# EAGLE schematic EMG3 (EAGLE 9.3.1)
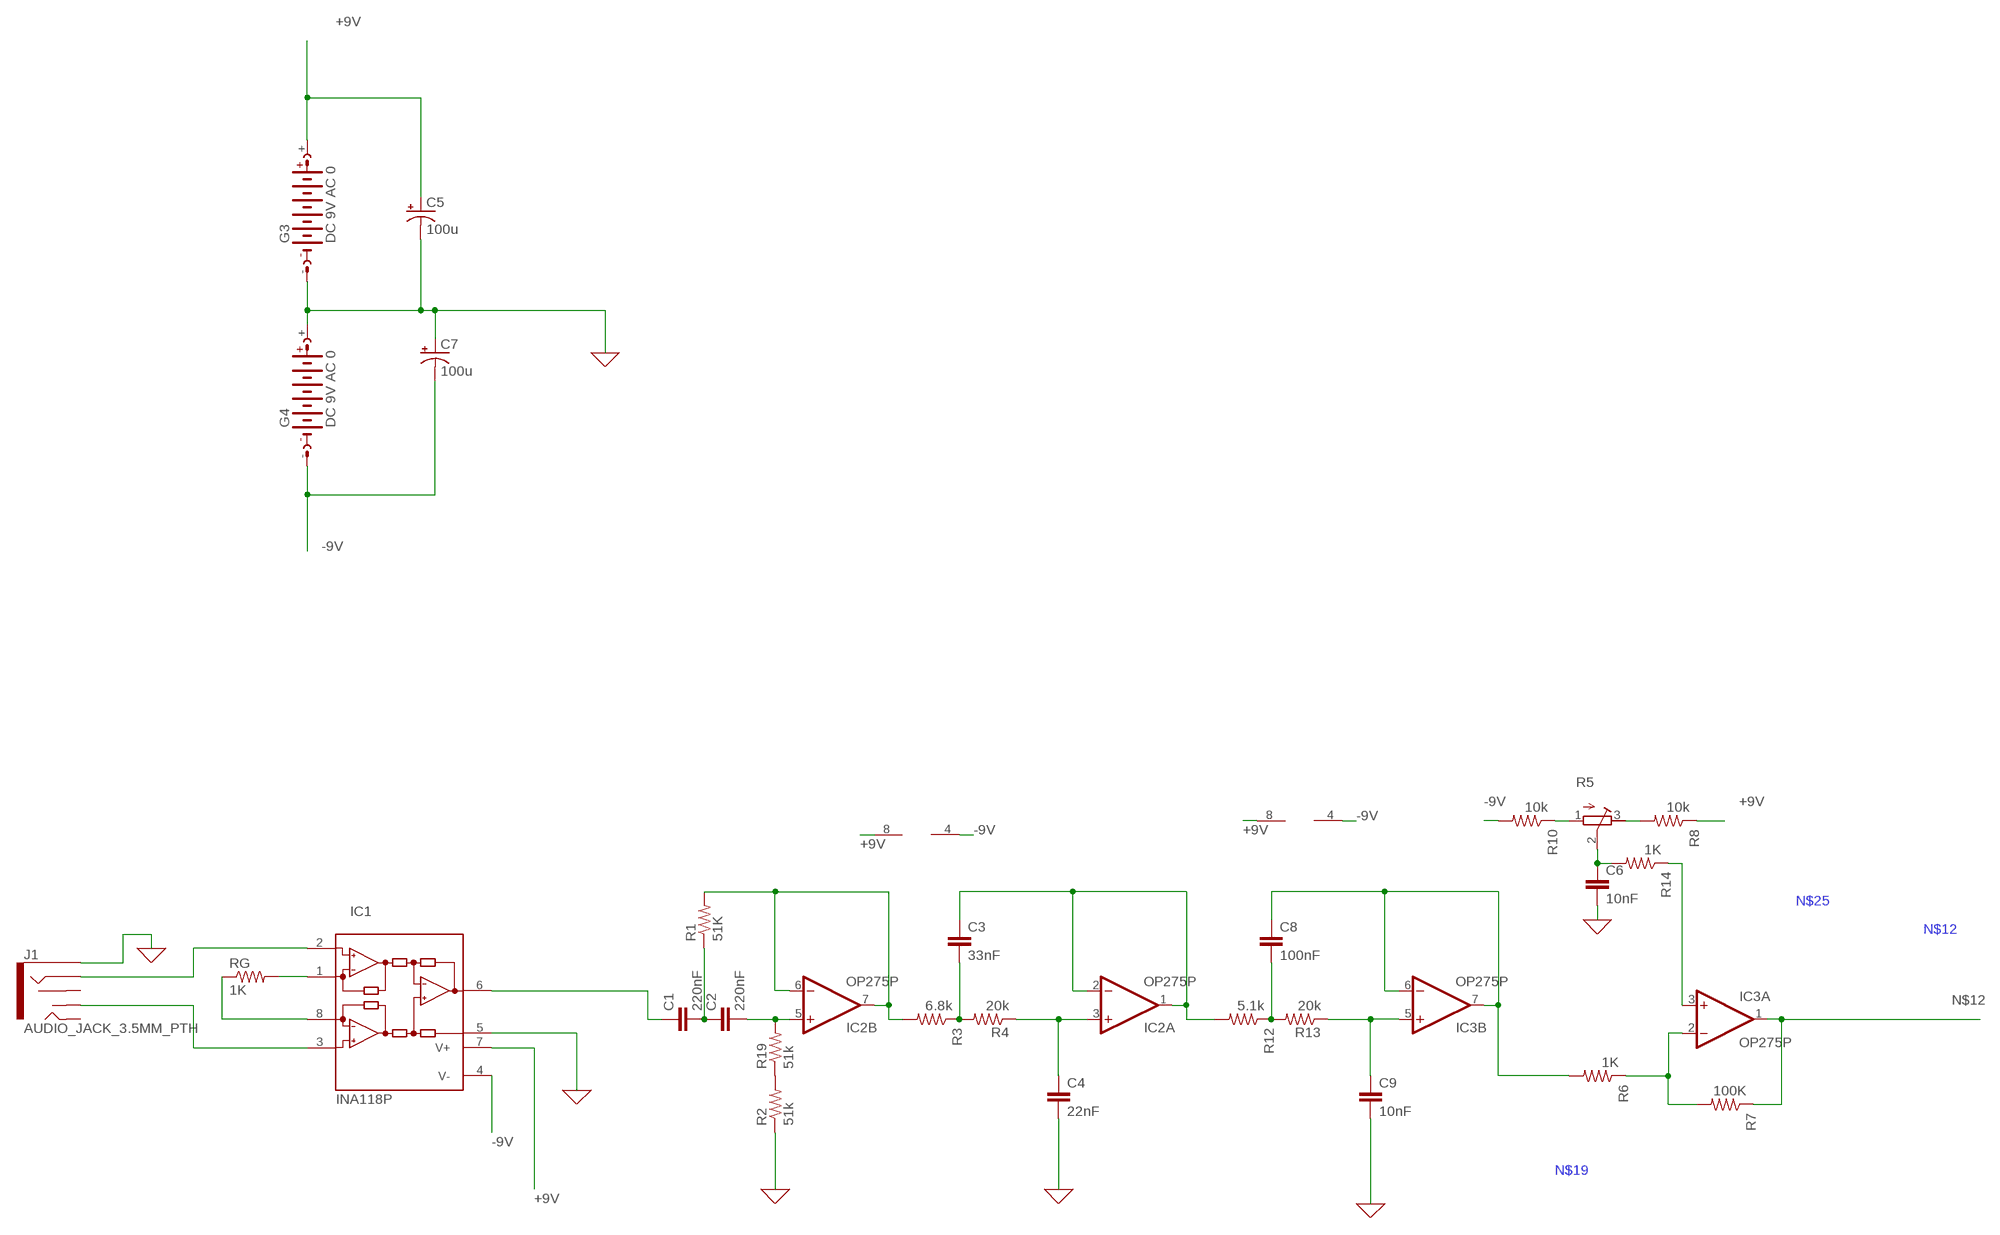
[diagram p0: schematic, sheet 1]

## Parts
C1  220nF  C-EU050-025X075  [C050-025X075]
C2  220nF  C-EU050-025X075  [C050-025X075]
C3  33nF  C-EU050-025X075  [C050-025X075]
C4  22nF  C-EU050-025X075  [C050-025X075]
C5  100u  CPOL-USE2.5-6  [E2,5-6]
C6  10nF  C-EU050-035X075  [C050-035X075]
C7  100u  CPOL-USE2.5-6  [E2,5-6]
C8  100nF  C-EU050-025X075  [C050-025X075]
C9  10nF  C-EU050-025X075  [C050-025X075]
G3  DC 9V AC 0  AB9V  [AB9V]
G4  DC 9V AC 0  AB9V  [AB9V]
IC1  INA118P  [DIL08]
IC2  OP275P  [DIL08]
IC3  OP275P  [DIL08]
J1  AUDIO_JACK_3.5MM_PTH  [AUDIO-JACK]
R1  51K  R-US_0207/12  [0207/12]
R2  51k  R-US_0207/12  [0207/12]
R3  6.8k  R-US_0207/12  [0207/12]
R4  20k  R-US_0207/12  [0207/12]
R5  R-TRIMM64W  [RTRIM64W]
R6  1K  R-US_0207/12  [0207/12]
R7  100K  R-US_0207/12  [0207/12]
R8  10k  R-US_0207/12  [0207/12]
R10  10k  R-US_0207/12  [0207/12]
R12  5.1k  R-US_0207/12  [0207/12]
R13  20k  R-US_0207/12  [0207/12]
R14  1K  R-US_0207/12  [0207/12]
R19  51k  R-US_0207/12  [0207/12]
RG  1K  R-US_0207/12  [0207/12]

## Nets
0: C4.2 C5.- C6.2 C7.+ C9.2 G3.- G4.+ IC1.5(REF) J1.SLEEVE R2.1 ; supply symbol labelled GND
+9V: C5.+ G3.+ IC1.7(V+) IC2.8(P:V+) IC3.8(P:V+) R8.1
-9V: C7.- G4.- IC1.4(V-) IC2.4(P:V-) IC3.4(P:V-) R10.2
N$1: IC1.1(RG) RG.2
N$2: IC1.8(RG) RG.1
N$3: IC1.2(-IN) J1.RING
N$4: C8.2 R12.1 R13.2
N$5: C1.2 C2.1 R1.1
N$6: C1.1 IC1.6(OUT)
N$7: C2.2 IC2.5(B:+IN) R19.2
N$8: IC2.6(B:-IN) IC2.7(B:OUT) R1.2 R3.2
N$9: C3.2 R3.1 R4.2
N$10: C4.1 IC2.3(A:+IN) R4.1
N$11: C3.1 IC2.1(A:OUT) IC2.2(A:-IN) R12.2
N$12: IC3.1(A:OUT) R7.1
N$14: C9.1 IC3.5(B:+IN) R13.1
N$15: R5.1(A) R10.1
N$16: C6.1 R5.2(S) R14.2
N$17: IC3.2(A:-IN) R6.1 R7.2
N$18: R2.2 R19.1
N$19: C8.1 IC3.6(B:-IN) IC3.7(B:OUT) R6.2
N$20: R5.3(E) R8.2
N$25: IC3.3(A:+IN) R14.1
N$26: IC1.3(+IN) J1.TSH
Unconnected: J1.RSH J1.TIP

## Library data of the parts
C1-C4 C6 C8 C9 = rcl:C-EU: CAPACITOR, European symbol; SPICEPREFIX: C
C5 C7 = rcl:CPOL-US: POLARIZED CAPACITOR, American symbol; SPICEPREFIX: C
G3 G4 = battery:AB9V: 9-V BATTERY CLIP; SPICEPREFIX: V
IC1 = burr-brown:INA118: Instrumentation Amplifier Precision, Low Power; MF: TEXAS INSTRUMENTS; MPN: INA118P; OC_FARNELL: 1470354; OC_NEWARK: 96K4515; SPICEMODEL: INA118a; SPICEPREFIX: X
IC2 IC3 = linear:OP275: Dual Very Low Noise Precision Operational Amplifier Source: http://www.analog.com/static/imported-files/data_sheets/OP270.pdf; SPICEMODEL: OP275p; SPICEPREFIX: X
J1 = SparkFun-Connectors:AUDIO_JACK_3.5MM: Audio Jack 3.5mm variants of PTH and SMT stereo audio jack with bypass switches. SparkFun Products: SparkFun SparkPunk Sound Kit <[https://www.sparkfun.com/products/11177]> - PTH MP3 Trigger <https://www.sparkfun.com/products/13720> -3.5mm SMD SparkFun PicoBoard <https://www.sparkfun.com/products/11888>- 2.5mm SMD; PROD_ID: CONN-08774; SF_ID: PRT-08032
R1-R4 R6-R8 R10 R12-R14 R19 RG = rcl:R-US_: RESISTOR, American symbol; SPICEPREFIX: R
R5 = rcl:R-TRIMM: Trimm resistor; SPICEMODEL: X; SPICEPREFIXL: POT

## Module MO
Ports: OUT(io) IN(io)
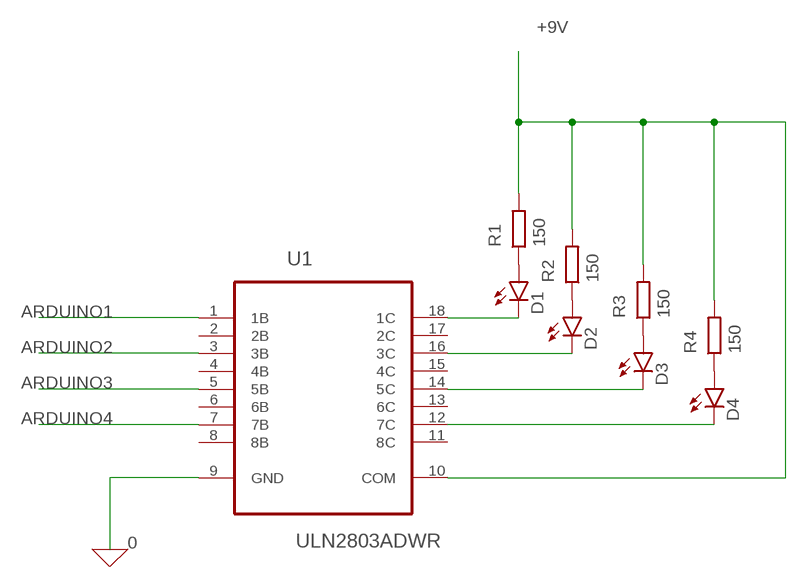
[diagram p1: schematic, module MO, sheet 1]

### Parts
D1  SFH482  [SFH482]
D2  SFH482  [SFH482]
D3  SFH482  [SFH482]
D4  SFH482  [SFH482]
R1  150  R  (no package)
R2  150  R  (no package)
R3  150  R  (no package)
R4  150  R  (no package)
U1  ULN2803ADWR  [SOIC127P1030X265-18N]

### Nets
0: U1.9(GND) ; supply symbol labelled GND
+9V: R1.2 R2.2 R3.2 R4.2 U1.10(COM)
ARDUINO1: U1.1(1B)
ARDUINO2: U1.3(3B)
ARDUINO3: U1.5(5B)
ARDUINO4: U1.7(7B)
N$1: D1.A R1.1
N$2: D2.A R2.1
N$3: D3.A R3.1
N$4: D4.A R4.1
N$5: D1.K(C) U1.18(1C)
N$9: D2.K(C) U1.16(3C)
N$10: D3.K(C) U1.14(5C)
N$11: D4.K(C) U1.12(7C)
Unconnected: U1.2(2B) U1.4(4B) U1.6(6B) U1.8(8B) U1.11(8C) U1.13(6C) U1.15(4C) U1.17(2C)

### Library data of the parts
D1-D4 = led:SFH482: IR LED infrared emitting diode, Infineon
R1-R4 = ngspice-simulation:R: RESISTOR
U1 = imported:ULN2803ADWR: Darlington transistor array; MPN: ULN2803ADWR; OC_FARNELL: 1652420; OC_NEWARK: 87H4769; PACKAGE: SOIC-18; SUPPLIER: TEXAS INSTRUMENTS